# EAGLE design LED_driver (EAGLE 7.7.0)
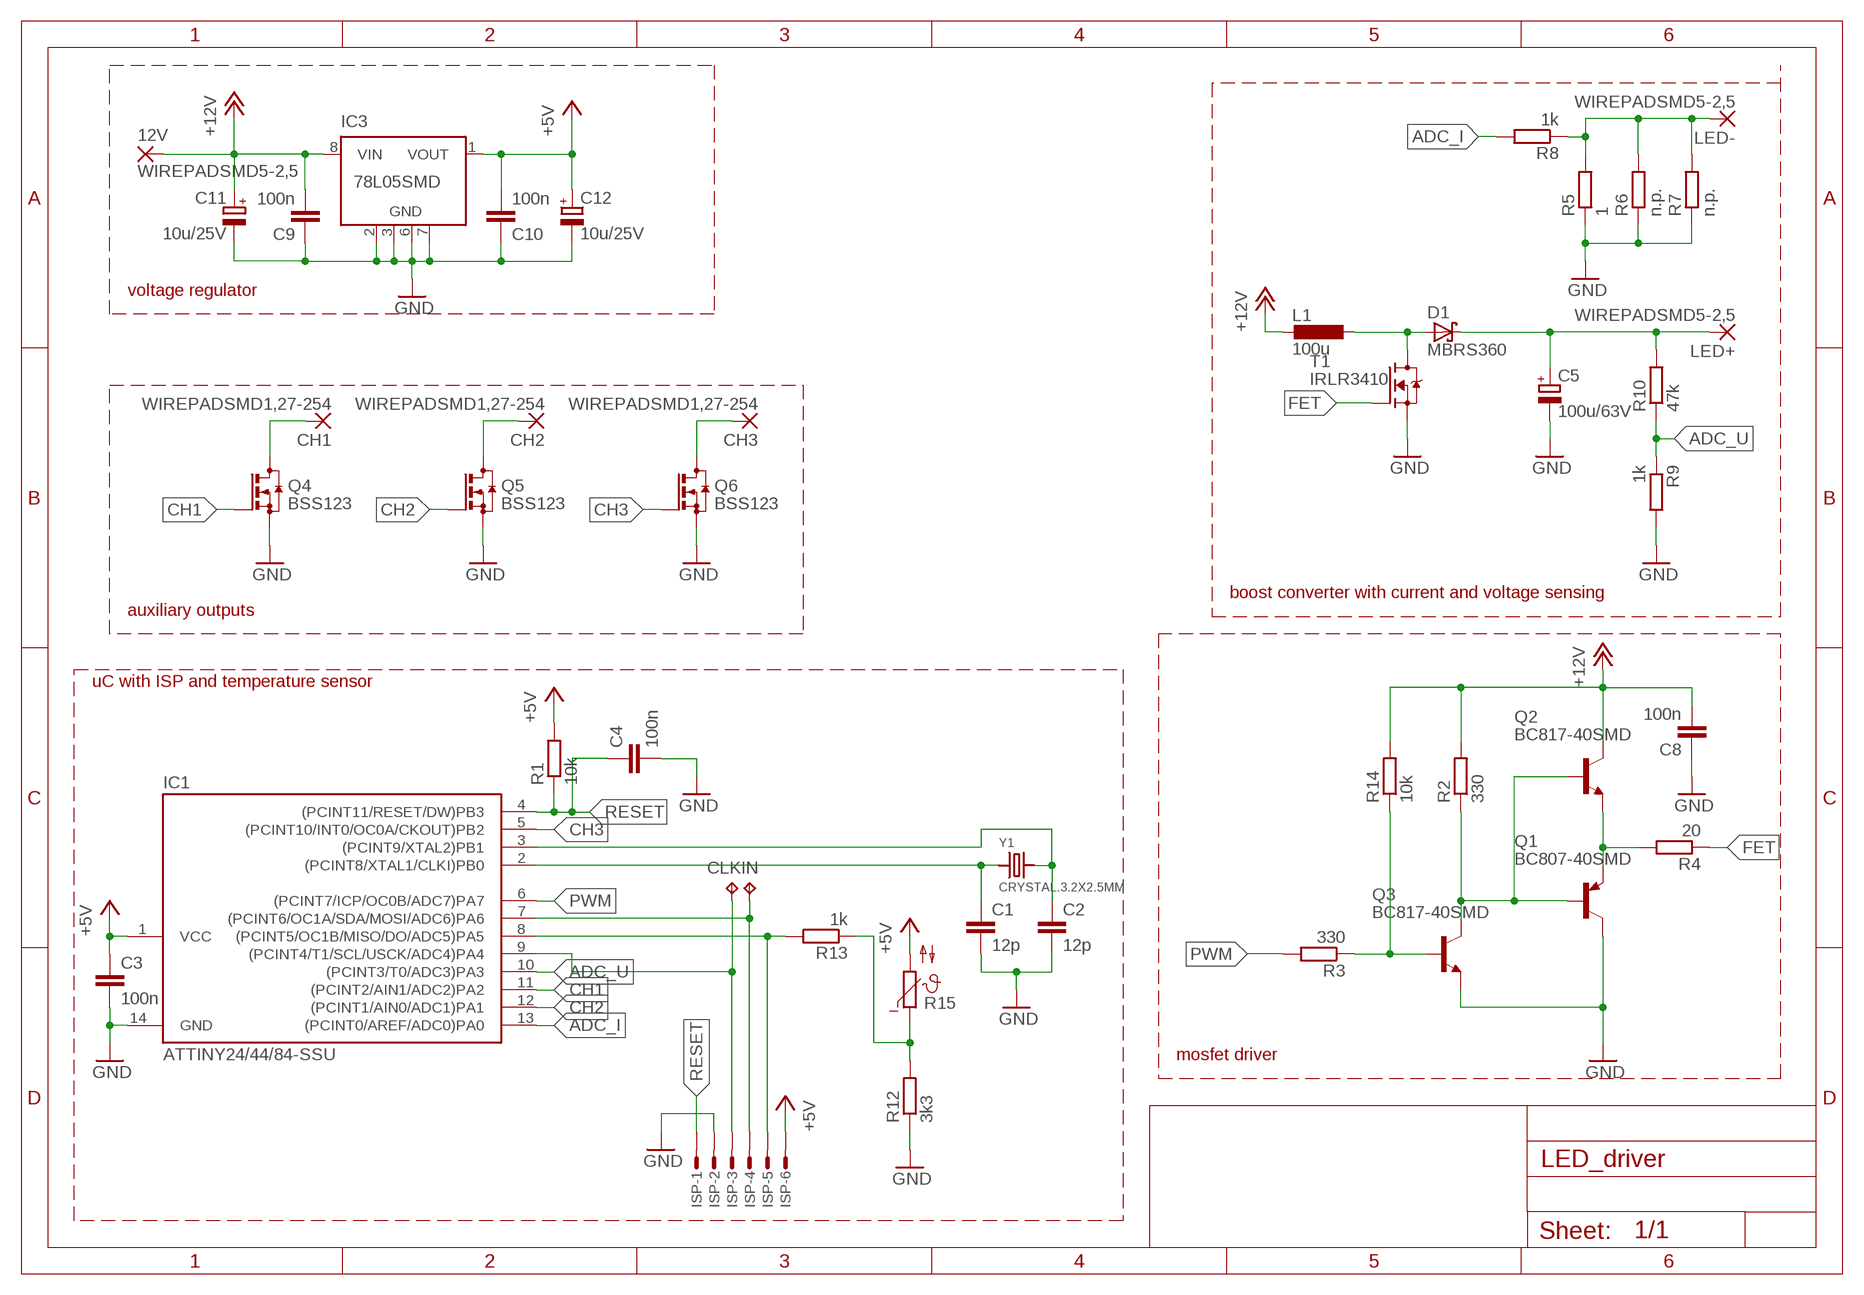
[diagram p0: schematic, sheet 1]

## Parts
12V  WIREPADSMD5-2,5  [5-2,5]
C1  12p  C-EUC0603K  [C0603K]
C2  12p  C-EUC0603K  [C0603K]
C3  100n  C-EUC0603K  [C0603K]
C4  100n  C-EUC0603K  [C0603K]
C5  100u/63V  CPOL-EU153CLV-1010  [153CLV-1010]
C8  100n  C-EUC0603K  [C0603K]
C9  100n  C-EUC0603K  [C0603K]
C10  100n  C-EUC0603K  [C0603K]
C11  10u/25V  CPOL-EU153CLV-0405  [153CLV-0405]
C12  10u/25V  CPOL-EU153CLV-0405  [153CLV-0405]
CH1  WIREPADSMD1,27-254  [SMD1,27-2,54]
CH2  WIREPADSMD1,27-254  [SMD1,27-2,54]
CH3  WIREPADSMD1,27-254  [SMD1,27-2,54]
CLK  TPTP15R  [TP15R]
D1  MBRS360  SCHOTTKY-DIODESMC  [SMC]
IC1  ATTINY24/44/84-SSU  [SOIC14]
IC3  78L05SMD  [SO08]
IN  TPTP15R  [TP15R]
ISP  MICROMATCH-6SMF  [MMT-F-SMD-6]
L1  100u  L-EUPISM  [PISM]
LED+  WIREPADSMD5-2,5  [5-2,5]
LED-  WIREPADSMD5-2,5  [5-2,5]
Q1  BC807-40SMD  [SOT23-BEC]
Q2  BC817-40SMD  [SOT23-BEC]
Q3  BC817-40SMD  [SOT23-BEC]
Q4  BSS123  [SOT23]
Q5  BSS123  [SOT23]
Q6  BSS123  [SOT23]
R1  10k  R-EU_R0603  [R0603]
R2  330  R-EU_R0603  [R0603]
R3  330  R-EU_R0603  [R0603]
R4  20  R-EU_R0603  [R0603]
R5  1  R-EU_R1206  [R1206]
R6  n.p.  R-EU_R1206  [R1206]
R7  n.p.  R-EU_R1206  [R1206]
R8  1k  R-EU_R0603  [R0603]
R9  1k  R-EU_R0603  [R0603]
R10  47k  R-EU_R0603  [R0603]
R12  3k3  R-EU_R0603  [R0603]
R13  1k  R-EU_R0603  [R0603]
R14  10k  R-EU_R0603  [R0603]
R15  NTC640  [P640]
T1  IRLR3410  [TO252]
Y1  CRYSTAL.3.2X2.5MM  [3.2X2.5MM]

## Nets
+5V: C3.1 C10.2 C12.+ IC1.1(VCC) IC3.1(VOUT) ISP.6 R1.2 R15.2
+12V: 12V.1(P) C8.2 C9.2 C11.+ IC3.8(VIN) L1.2 Q2.C R2.2 R14.2
ADC_I: IC1.13((PCINT0/AREF/ADC0)PA0) R8.2
ADC_U: IC1.10((PCINT3/T0/ADC3)PA3) R9.1 R10.1
CH1: IC1.11((PCINT2/AIN1/ADC2)PA2) Q4.1(G)
CH1_OUT: CH1.1(P) Q4.3(D)
CH2: IC1.12((PCINT1/AIN0/ADC1)PA1) Q5.1(G)
CH2_OUT: CH2.1(P) Q5.3(D)
CH3: IC1.5((PCINT10/INT0/OC0A/CKOUT)PB2) Q6.1(G)
CH3_OUT: CH3.1(P) Q6.3(D)
FET: R4.1 T1.1(G)
GND: C1.2 C2.2 C3.2 C4.2 C5.- C8.1 C9.1 C10.1 C11.- C12.- IC1.14(GND) IC3.2(GND) IC3.3(GND) IC3.6(GND) IC3.7(GND) ISP.2 Q1.C Q3.E Q4.2(S) Q5.2(S) Q6.2(S) R5.1 R6.1 R7.1 R9.2 R12.1 T1.2(S)
LED+: C5.+ D1.C LED+.1(P) R10.2
LED-: LED-.1(P) R5.2 R6.2 R7.2 R8.1
MISO: IC1.8((PCINT5/OC1B/MISO/DO/ADC5)PA5) ISP.5 R13.2
MOSI: IC1.7((PCINT6/OC1A/SDA/MOSI/ADC6)PA6) IN.TP ISP.4
N$1: D1.A L1.1 T1.3(D)
N$8: Q3.B R3.1 R14.1
PP_IN: Q1.B Q2.B Q3.C R2.1
PP_OUT: Q1.E Q2.E R4.2
PWM: IC1.6((PCINT7/ICP/OC0B/ADC7)PA7) R3.2
RESET: C4.1 IC1.4((PCINT11/RESET/DW)PB3) ISP.1 R1.1
SCK: CLK.TP IC1.9((PCINT4/T1/SCL/USCK/ADC4)PA4) ISP.3
TEMP: R12.2 R13.1 R15.1
XTAL1: C1.1 IC1.2((PCINT8/XTAL1/CLKI)PB0) Y1.1
XTAL2: C2.1 IC1.3((PCINT9/XTAL2)PB1) Y1.3
Unconnected: IC3.4(NC) IC3.5(NC)

## Notes on the sheet
- voltage regulator
- boost converter with current and voltage sensing
- auxiliary outputs
- uC with ISP and temperature sensor
- mosfet driver

## Library data of the parts
12V CH1-CH3 LED+ LED- = wirepad:WIREPAD: Wire PAD connect wire on PCB
C1-C4 C8-C10 = rcl:C-EU: CAPACITOR, European symbol
C5 C11 C12 = rcl:CPOL-EU: POLARIZED CAPACITOR, European symbol
CLK IN = testpad:TP: Test pad
D1 = diode:SCHOTTKY-DIODE: Schottky Diode
IC1 = attiny24_44_84:ATTINY24/44/84
IC3 = linear:78L*SMD: Positive VOLTAGE REGULATOR
ISP = con-amp-micromatch2:MICROMATCH-6: MicroMaTch 6 7-215464-6 / 0-215464-6 Drawing Number C-215464 DDEController.pdf
L1 = inductor-Fastron:L-EU
Q1 = transistor-pnp:BC807*: PNP Transistror
Q2 Q3 = transistor-npn:BC817*: NPN Transistor
Q4-Q6 = transistor-small-signal:BSS123: N-CHANNEL MOS FET
R1-R4 R8-R10 R12-R14 = rcl:R-EU_: RESISTOR, European symbol
R5-R7 = resistor:R-EU_: RESISTOR, European symbol
R15 = ptc-ntc:NTC640: PHILIPS NTC; OC_FARNELL: unknown; OC_NEWARK: unknown
T1 = transistor-ir:IRLR3410
Y1 = abracon:CRYSTAL

## Board
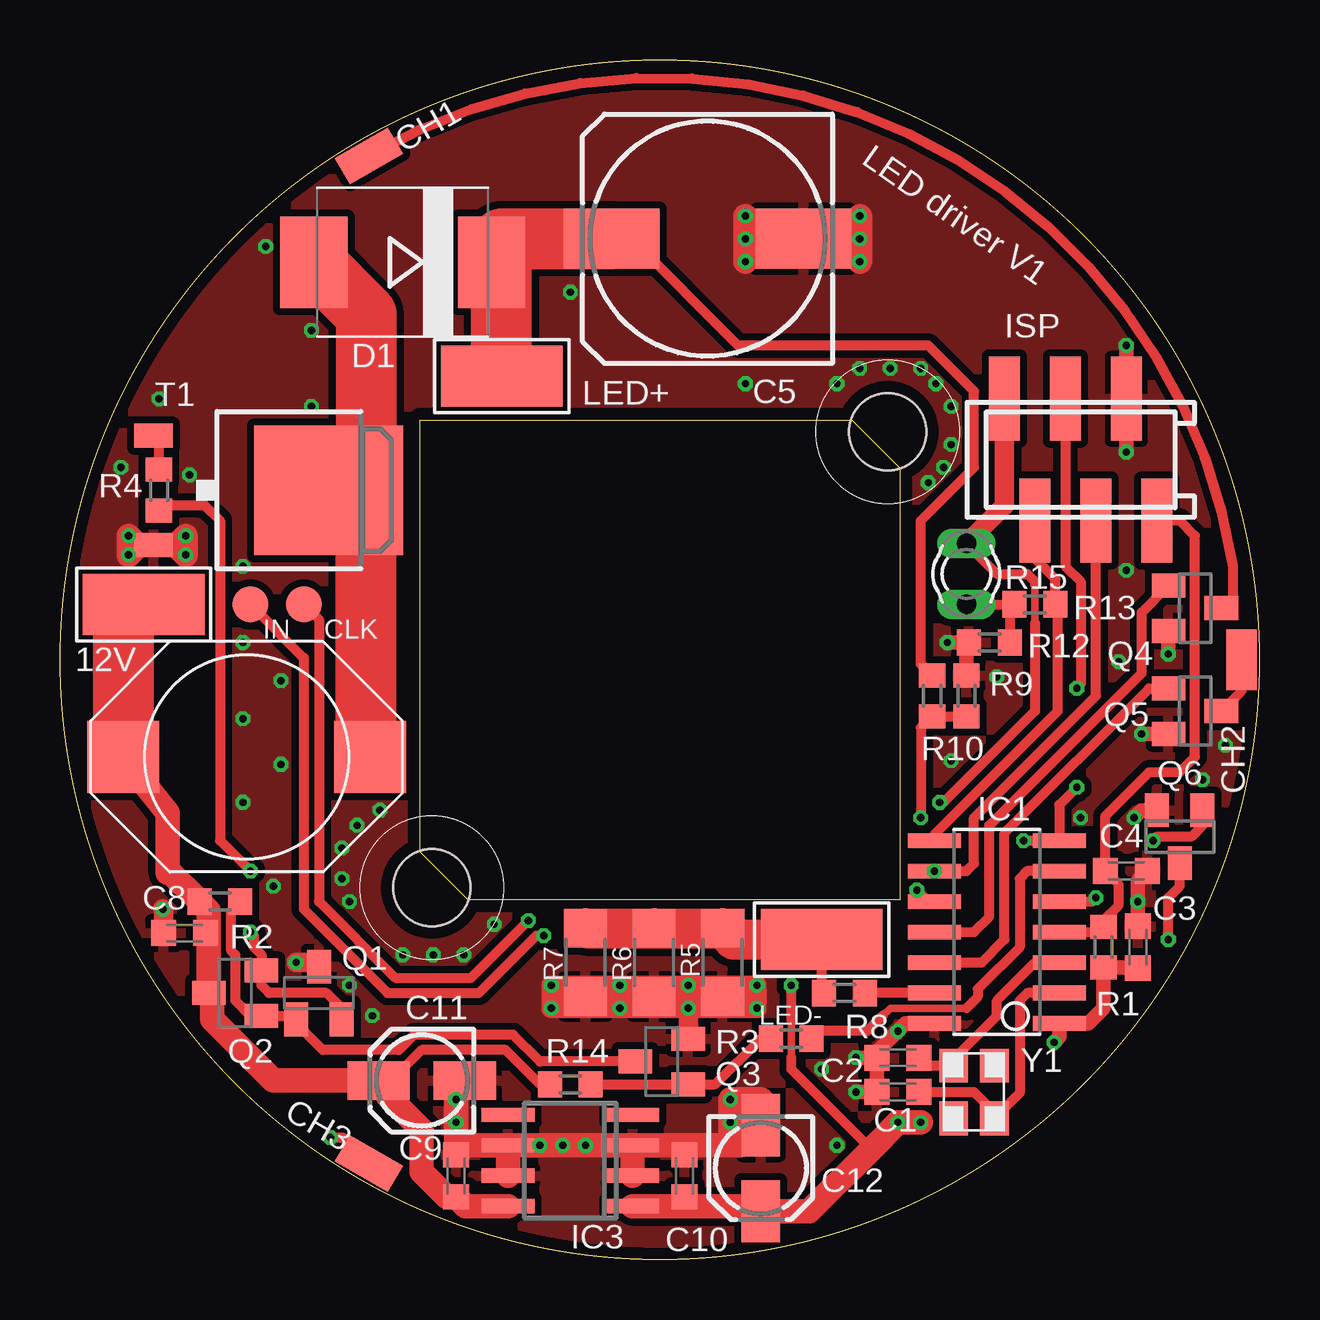
[diagram p1: board, top side]
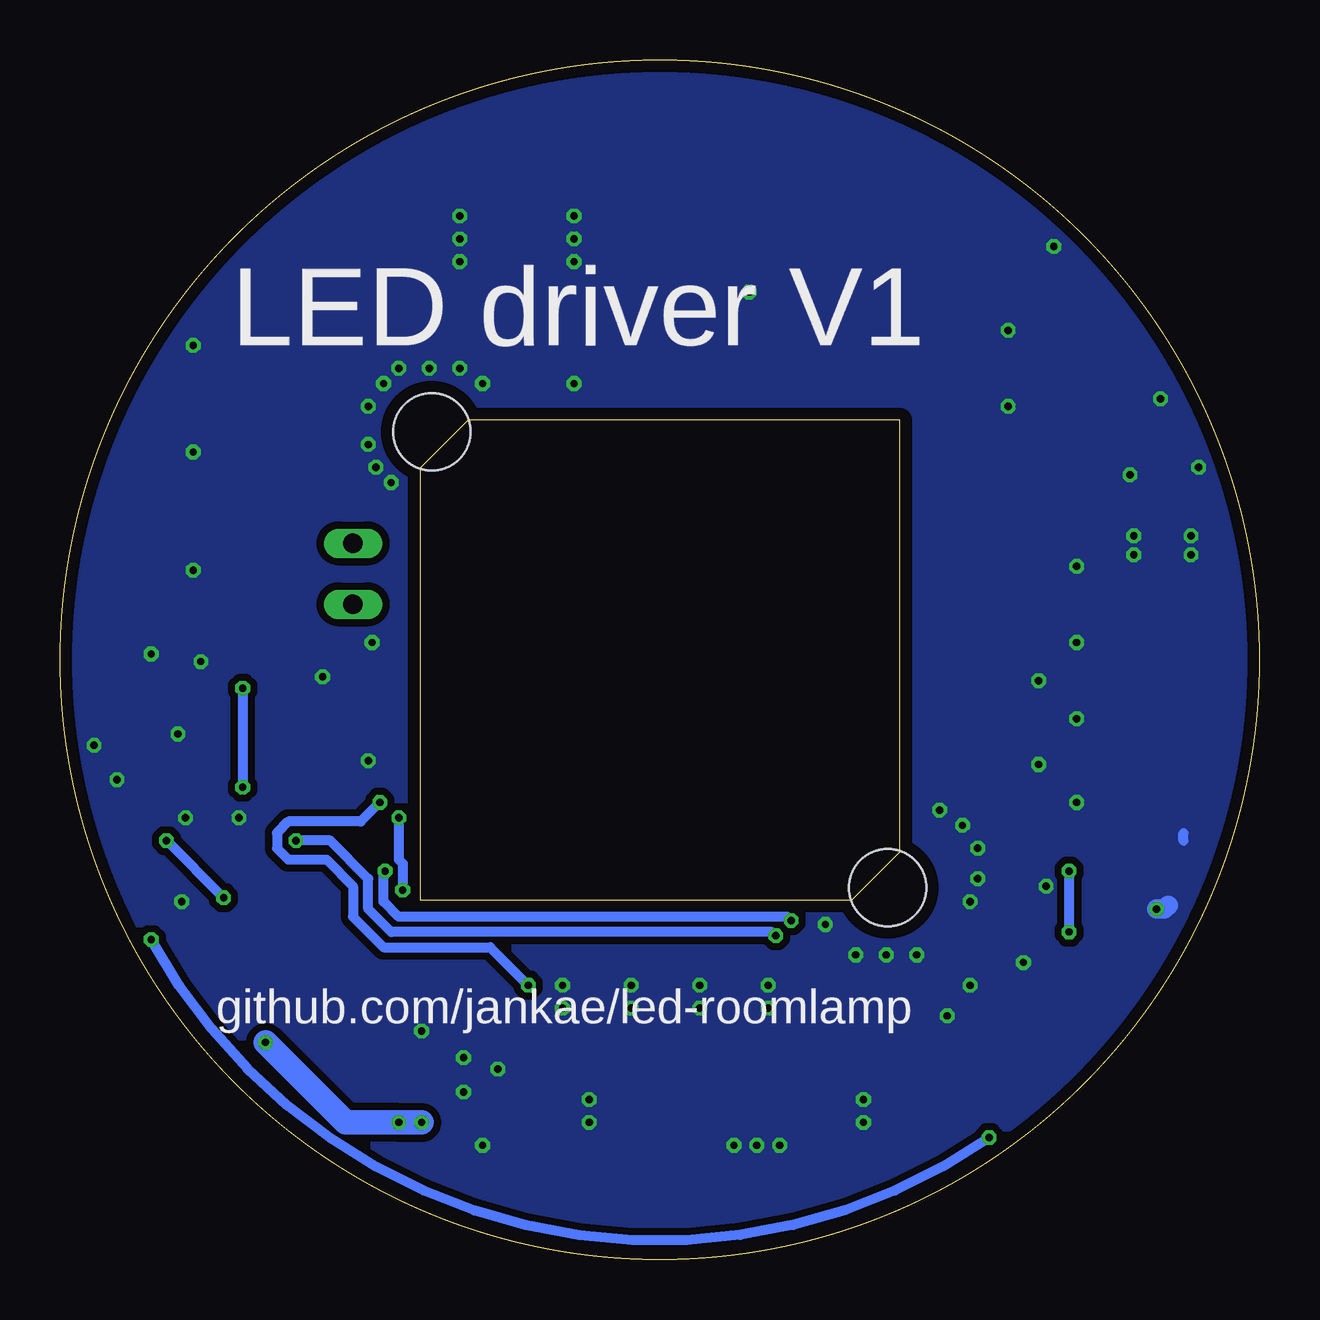
[diagram p2: board, bottom side, seen from below]

Size 50 x 50 mm. Coordinates in mm from the lower left corner, seen from the top.
Outline: 15,35 33,35 35,33 35,15 17,15 15,17 15,35
Outline: circle at 25,25 radius 25
Copper layers (1*16): Top 0.035mm / dielectric 1.6mm / Bottom 0.035mm
Design rules "Elecrow_2-layer_PCB_eagle_rule": minimum track width 6mil, minimum drill 12mil, track to track 6mil, track to pad 6mil, pad to pad 6mil, via to via 8mil, smd to smd 0mil, copper to edge 20mil, drill to drill 10mil, minimum pad ring 6mil, minimum via ring 6mil, stop-mask expansion 0mil, vias tented up to drill 100mil, thermal gap 10mil
Holes 3.2 mm at 34.5,34.5 15.5,15.5

### Footprints (pad centres in the part's own frame; a part is rotated, then mirrored left to right if it is on the bottom)
5-2,5 = smd 2.54 x 5.08: 1 0,0
C0603K = smd 1.05 x 1.08: 1 -0.875,0; 2 0.875,0
153CLV-1010 = smd 4 x 2.5: + 4,0; - -4,0
153CLV-0405 = smd 2.6 x 1.6: + 1.8,0; - -1.8,0
SMD1,27-2,54 = smd 1.27 x 2.54: 1 0,0
TP15R = smd 1.5 x 1.5: TP 0,0
SMC = smd 2.8 x 3.8: A 3.7,0; C -3.7,0
SOIC14 = smd 0.61 x 2.21: 1 -3.81,-2.603; 2 -2.54,-2.603; 3 -1.27,-2.603; 4 0,-2.603; 5 1.27,-2.603; 6 2.54,-2.603; 7 3.81,-2.603; 8 3.81,2.603; 9 2.54,2.603; 10 1.27,2.603; 11 0,2.603; 12 -1.27,2.603; 13 -2.54,2.603; 14 -3.81,2.603
SO08 = smd 0.6 x 2.2: 1 -1.905,-2.6; 2 -0.635,-2.6; 3 0.635,-2.6; 4 1.905,-2.6; 5 1.905,2.6; 6 0.635,2.6; 7 -0.635,2.6; 8 -1.905,2.6
MMT-F-SMD-6 = smd 1.3 x 3.5: 1 3.175,-2.54; 2 1.905,2.54; 3 0.635,-2.54; 4 -0.635,2.54; 5 -1.905,-2.54; 6 -3.175,2.54
PISM = smd 3 x 3: 1 -5.15,0; 2 5.15,0
SOT23-BEC = smd 1 x 1.4: B -0.95,-1.1; C 0,1.1; E 0.95,-1.1
SOT23 = smd 1 x 1.4: 1 -0.95,-1.1; 2 0.95,-1.1; 3 0,1.1
R0603 = smd 1 x 1.1: 1 -0.85,0; 2 0.85,0
R1206 = smd 1.6 x 1.803: 1 -1.422,0; 2 1.422,0
P640 = drill 0.813 long: 1 -1.27,0; 2 1.27,0
TO252 = smd 1 x 1.6: 1 -2.28,-6.07; 2 2.28,-6.07 | smd 5.4 x 6.2: 3 0,1.23
3.2X2.5MM = smd 1.4 x 1.2: 1 -1.1,-0.85; 2 1.1,-0.85; 3 1.1,0.85; 4 -1.1,0.85

### Placement (x,y rotation side)
12V  3.49,27.3 90 top
C1  34.92,6.99 180 top
C2  34.92,8.41 180 top
C3  44.93,13.02 90 top
C4  44.45,16.19 0 top
C5  26.99,42.55 180 top
C8  5.19,13.61 0 top
C9  16.51,3.49 270 top
C10  26.04,3.49 270 top
C11  15.08,7.46 180 top
C12  29.21,3.81 270 top
CH1  12.88,46 120 top
CH2  49.25,25 0 top
CH3  12.88,4 240 top
CLK  10.16,27.3 0 top
D1  14.29,41.57 180 top
IC1  39.05,13.65 90 top
IC3  21.27,4.13 90 top
IN  7.94,27.3 0 top
ISP  42.55,33.34 0 top
L1  7.78,20.95 180 top
LED+  18.41,36.83 90 top
LED-  31.75,13.34 90 top
Q1  10.79,11.11 0 top
Q2  7.3,11.11 90 top
Q3  25.08,8.26 90 top
Q4  47.31,27.15 270 top
Q5  47.31,22.86 270 top
Q6  46.67,17.62 180 top
R1  43.5,13.02 270 top
R2  6.67,14.92 180 top
R3  30.48,9.21 0 top
R4  4.13,32.07 270 top
R5  27.62,12.38 90 top
R6  24.77,12.38 90 top
R7  21.91,12.38 90 top
R8  32.7,11.11 0 top
R9  37.78,23.5 90 top
R10  36.35,23.5 90 top
R12  38.73,25.72 0 top
R13  40.64,27.3 0 top
R14  21.27,7.3 180 top
R15  37.78,28.57 90 top
T1  9.97,32.07 270 top
Y1  38.1,6.99 90 top

### Tracks (layer width: path | path; a pad name or v marks a point on that pad's centre or on a via)
+5V  (via drill 0.3)
  Top 0.305: 30.48,8.41 30.48,10 | 40.64,28.1 40.64,26.51
  Top 0.406: R15.2 39.05,28.57 40.32,28.57 40.64,28.26 40.64,28.1 | v36.67,19.05 36.83,19.05 40.64,22.86 40.64,26.51 | 33.81,4.6 30.48,7.94 30.48,8.41 | 30.48,10 v30.48,11.43
  Top 0.61: v41.43,9.05 41.66,9.27 IC1.1 42.86,9.84 43.5,10.48 R1.2 44.25,12.17 C3.1
  Top 0.813: C10.2 26.04,2.22 | ISP.6 39.37,31.43 R15.2
  Top 1.016: IC3.1 26.04,2.22 29,2.22 C12.+ 31.22,2.01 33.81,4.6 v34.92,5.71 v35.88,5.71
  Bottom 0.406: v36.67,19.05 37.47,18.26 40.48,18.26 40.96,17.78 40.96,17.14 40.48,16.67 38.89,16.67 37.78,15.56 37.78,14.29 36.51,13.02 32.07,13.02 v30.48,11.43
  Bottom 1.016: v41.43,9.05 38.1,5.71 v35.88,5.71 v34.92,5.71
+12V
  Top 0.406: R14.2 20,7.3 18.57,8.73 15.08,8.73 13.81,7.46 C11.+ | C8.2 6.07,14.67 6.03,14.71
  Top 1.016: 4.5,16.24 R2.2 6.03,14.71 6.2,14.54 Q2.C 6.35,10.96 6.35,10 8.89,7.46 C11.+ 13.65,7.09 13.65,6.83 15.08,5.4 15.08,3.65 16.11,2.62 C9.2 16.91,2.22 IC3.8 | 4.5,16.12 4.5,16.24 | 4.5,16.24 4.5,18.61 L1.2
  Top 2.54: 12V.1 2.63,27.3 L1.2
ADC_I
  Top 0.406: IC1.13 R8.2
ADC_U  (via drill 0.3)
  Top 0.406: 35.72,15.24 v35.72,15.4 36.2,14.92 IC1.10 | R9.1 R10.1 35.88,22.17 v35.88,18.41
  Bottom 0.406: v35.88,18.41 35.88,16.67 35.72,16.51 v35.72,15.4
CH1
  Top 0.406: IC1.11 38.1,13.65 38.73,14.29 38.73,18.1 45.09,24.45 45.09,26.97 Q4.1
CH1_OUT
  Top 0.406: CH1.1 arc-111 48.9,28.89 48.9,27.48 Q4.3
CH2
  Top 0.406: IC1.12 38.42,12.38 39.37,13.34 39.37,17.78 45.4,23.81 Q5.1
CH2_OUT
  Top 0.406: Q5.3 49.25,23.7 CH2.1
CH3  (via drill 0.3)
  Top 0.406: IC1.5 43.02,14.92 v43.18,15.08 | Q6.1 47.62,18.09 47.15,17.62 45.72,17.62 v45.56,17.46
  Bottom 0.406: v43.18,15.08 v45.56,17.46
CH3_OUT  (via drill 0.3)
  Top 0.406: CH3.1 11.79,5.08 v11.27,5.08 | v46.2,13.34 46.2,15.08 46.67,15.56 Q6.3
  Bottom 0.406: v11.27,5.08 arc96 v46.2,13.34
FET
  Top 0.406: R4.1 4.13,34.25 T1.1
GND  (via drill 0.3)
  Top 0.406: R7.1 20.64,10.95 | R6.1 24.76,10.95 24.45,10.95 | R5.1 27.94,10.95 | v16.51,6.67 16.88,7.04 C11.-
  Top 0.61: IC1.14 35.24,9.84 34.05,8.65 C2.2 | C2.2 C1.2 | v33.18,8.41 C2.2 | v33.18,6.99 33.97,6.99 | C3.2 v44.93,14.92 44.93,15.79 C4.2 | v36.99,25.72 R12.1 37.78,25.61 R9.2 | v44.77,18.41 45.07,18.72 Q6.2 | v45.09,21.91 Q5.2 | v46.2,25.24 46.21,25.25 Q4.2 | v44.45,33.66 ISP.2 v44.45,38.1
  Top 0.813: v26.19,10.48 v20.48,10.48 20.48,10.95 | v26.19,10.48 v29.05,10.48 29.05,10.95 | 29.05,10.95 v29.05,11.43 v20.48,11.43 20.48,10.95 | 20.48,10.95 20.64,10.95 24.45,10.95 27.94,10.95 29.05,10.95 | Q3.E 26.19,9.22 v26.19,10.48 | v9.84,12.38 10.62,12.38 Q1.C | C8.1 4.32,14.57 v4.29,14.61
  Top 1.016: IC3.6 IC3.7 | IC3.2 IC3.3 | IC3.6 IC3.3 | IC3.6 16.51,4.76 C9.1 | IC3.3 26.04,4.76 | 26.04,4.76 27.94,4.76 | 27.94,4.76 28.36,4.76 C12.- | C10.1 26.04,4.76 | T1.2 4.82,29.79 v5.24,29.37 | 5.24,29.53 v5.24,30.16 4.92,29.84 | C5.- v33.34,42.55 v33.34,43.5 v33.34,41.59 | v28.57,43.5 v28.57,41.59 | 16.51,4.87 v16.51,6.67 | 29.21,6.67 v27.94,6.67 27.94,4.76 | v2.86,29.37 v2.86,30.16 3.17,29.84 3.17,29.69 v2.86,29.37
  Bottom 0.406: 3.17,17.46 3.17,17.78
  Bottom 0.813: v4.29,14.61 3.97,14.61 3.81,14.76
  other vias: 28.57,42.55 16.51,5.71 27.94,5.71 20,4.76 20.95,4.76 21.91,4.76 26.19,11.43 23.34,10.48 23.34,11.43 44.13,24.92 44.45,28.73 39.05,24.29 37.15,20.8 48.58,21.43 47.62,20 42.55,18.41 34.92,9.53 31.75,7.94 32.38,4.76 13.02,10.16 12.06,11.43 8.89,15.56 7.62,25.72 9.21,24.13 7.62,22.54 9.21,20.64 7.62,19.05 7.62,22.54 13.34,18.73 11.75,15.88 16.83,12.7 18.1,13.97 36.2,32.38 37.15,35.56 35.88,37.15 32.38,36.51 28.57,36.51 21.27,40.32 2.54,33.02 8.57,42.23 7.62,28.89 5.4,32.7 4.13,35.88 10.48,35.56 10.48,38.73 12.38,18.1 11.75,17.14 12.06,14.92 14.29,12.7 15.56,12.7 36.83,33.02 37.15,33.97 36.51,36.51 34.61,37.15 33.34,37.15
  pour Bottom (isolate 0.305): -1.91,54.61 -1.91,-2.54 55.24,-2.54 55.24,54.61
  pour Top (isolate 0.305): 53.98,53.34 53.98,-3.81 -3.17,-3.81 -3.17,53.34
LED+
  Top 0.406: C5.+ 23.81,42.55 28.26,38.1 36.2,38.1 38.1,36.2 38.1,33.02 35.88,30.8 35.88,24.82 R10.2
  Top 1.016: D1.C 20,41.93 20,42.55
  Top 2.54: C5.+ 20,42.55 18.41,42.55 LED+.1
LED-
  Top 0.406: R8.1 31.75,11.21 LED-.1
  Top 1.676: R7.2 R6.2 R5.2 28.09,13.34 LED-.1
MISO
  Top 0.406: IC1.8 36.45,17.72 41.59,22.86 41.59,27.2 R13.2 41.49,28.36 40.64,29.21 ISP.5
MOSI  (via drill 0.3)
  Top 0.406: IN.TP 10.16,25.08 10.16,14.61 13.65,11.11 17.46,11.11 19.84,13.49 v20.16,13.49 | v40.16,17.46 IC1.7 41.66,18.95 v42.39,19.68 | ISP.4 41.91,28.89 42.55,28.26 42.55,23.97 v42.39,23.81
  Bottom 0.406: v20.16,13.49 20.32,13.65 36.2,13.65 37.15,14.61 37.15,15.88 38.73,17.46 v40.16,17.46 | v42.39,23.81 v42.39,19.68
N$1
  Top 2.54: L1.1 12.77,21.27 12.77,30.82 | 12.77,30.82 T1.3 | 12.77,30.82 12.77,39.38 D1.A
N$8
  Top 0.406: R14.1 Q3.B 27.31,7.3 29.21,9.21 R3.1
PP_IN
  Top 0.406: R2.1 7.14,14.55 7.14,12.86 7.3,12.7 7.3,10.79 7.93,10.16 Q2.B | 9.68,9.85 Q1.B | 8.09,10.01 Q2.B | Q3.C 20,8.26 18.89,9.37 14.76,9.37 14.13,8.73 10.95,8.73 9.85,9.84 Q1.B | Q2.B 9.7,10.16 Q1.B
PP_OUT  (via drill 0.3)
  Top 0.406: 8.09,13.02 8.09,13.51 v7.94,13.65 | R4.2 4.34,31.43 6.03,31.43 6.67,30.8 6.67,17.46 v7.94,16.19 | 8.09,13.02 | Q1.E 11.74,10.48 11.11,11.11 8.72,11.11 8.4,11.43 Q2.E 8.4,12.7 8.09,13.02
  Bottom 0.406: v7.94,13.65 v7.94,16.19
PWM
  Top 0.305: 37.78,10.48 34.61,10.48 34.29,10.16
  Top 0.406: IC1.6 40.32,16.19 40.01,15.88 40.01,13.02 38.26,11.27 38.26,10.95 37.78,10.48 | 34.29,10.16 33.66,9.53 31.65,9.53 R3.2
RESET
  Top 0.406: IC1.4 43.81,13.65 R1.1 43.5,14.13 44.13,14.76 44.13,15.63 C4.1 43.58,18.49 45.4,20.32 46.67,20.32 47.31,20.95 47.31,30.16 46.67,30.8 ISP.1
SCK  (via drill 0.3)
  Top 0.406: CLK.TP 10.79,26.67 10.79,14.92 13.97,11.75 17.14,11.75 v19.53,14.13 | IC1.9 37.78,16.19 38.1,16.51 38.1,18.41 43.18,23.5 ISP.3
  Bottom 0.406: v19.53,14.13 19.68,14.29 35.88,14.29 36.51,14.92 36.51,16.13 IC1.9
  other vias: 36.45,16.19
TEMP
  Top 0.406: R15.1 R13.1 39.59,27.1 R12.2
XTAL1
  Top 0.406: IC1.2 40.32,11.11 40.01,10.79 40.01,6.94 Y1.1 38.95,6.13 38.1,6.99 C1.1
XTAL2
  Top 0.406: IC1.3 40.64,12.38 39.05,10.79 39.05,10.16 37.25,8.36 Y1.3 36.13,8.09 C2.1

### Text on the board
tNames: LED driver V1
bNames: LED driver V1 | github.com/jankae/led-roomlamp